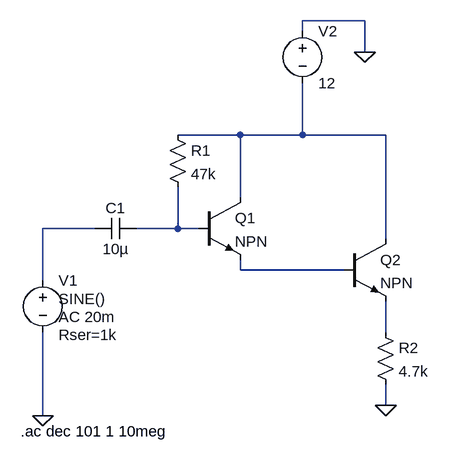
[diagram p0: schematic exp_7_iii_zi-woutb_electro.asc]
exp_7_iii_zi-woutb_electro.asc, the LTspice schematic file:
Version 4
SHEET 1 880 680
WIRE 528 -224 432 -224
WIRE 432 -208 432 -224
WIRE 528 -176 528 -224
WIRE 336 -48 240 -48
WIRE 432 -48 432 -128
WIRE 432 -48 336 -48
WIRE 560 -48 432 -48
WIRE 336 48 336 -48
WIRE 112 96 32 96
WIRE 240 96 240 32
WIRE 240 96 176 96
WIRE 272 96 240 96
WIRE 560 112 560 -48
WIRE 336 160 336 144
WIRE 496 160 336 160
WIRE 32 176 32 96
WIRE 560 256 560 208
WIRE 560 368 560 336
WIRE 32 384 32 256
FLAG 528 -176 0
FLAG 32 384 0
FLAG 560 368 0
SYMBOL voltage 32 160 R0
WINDOW 3 24 44 Left 2
WINDOW 123 24 72 Left 2
WINDOW 39 24 100 Left 2
SYMATTR InstName V1
SYMATTR Value SINE()
SYMATTR Value2 AC 20m
SYMATTR SpiceLine Rser=1k
SYMBOL cap 176 80 R90
WINDOW 0 0 32 VBottom 2
WINDOW 3 32 32 VTop 2
SYMATTR InstName C1
SYMATTR Value 10µ
SYMBOL res 224 -64 R0
SYMATTR InstName R1
SYMATTR Value 47k
SYMBOL npn 272 48 R0
SYMATTR InstName Q1
SYMBOL npn 496 112 R0
SYMATTR InstName Q2
SYMBOL voltage 432 -224 R0
WINDOW 123 0 0 Left 0
WINDOW 39 0 0 Left 0
SYMATTR InstName V2
SYMATTR Value 12
SYMBOL res 544 240 R0
SYMATTR InstName R2
SYMATTR Value 4.7k
TEXT -2 408 Left 2 !.ac dec 101 1 10meg

The netlist it stands for:
* exp_7_iii_zi-woutb_electro.asc
V1 N002 0 SINE() AC 20m Rser=1k
C1 N003 N002 10µ
R1 N001 N003 47k
Q1 N001 N003 N004 0 NPN
Q2 N001 N004 N005 0 NPN
V2 0 N001 12
R2 N005 0 4.7k
.model NPN NPN
.model PNP PNP
.lib standard.bjt
.ac dec 101 1 10meg
.backanno
.end